# Altium schematic sheet Sheet11.SchDoc
size A4
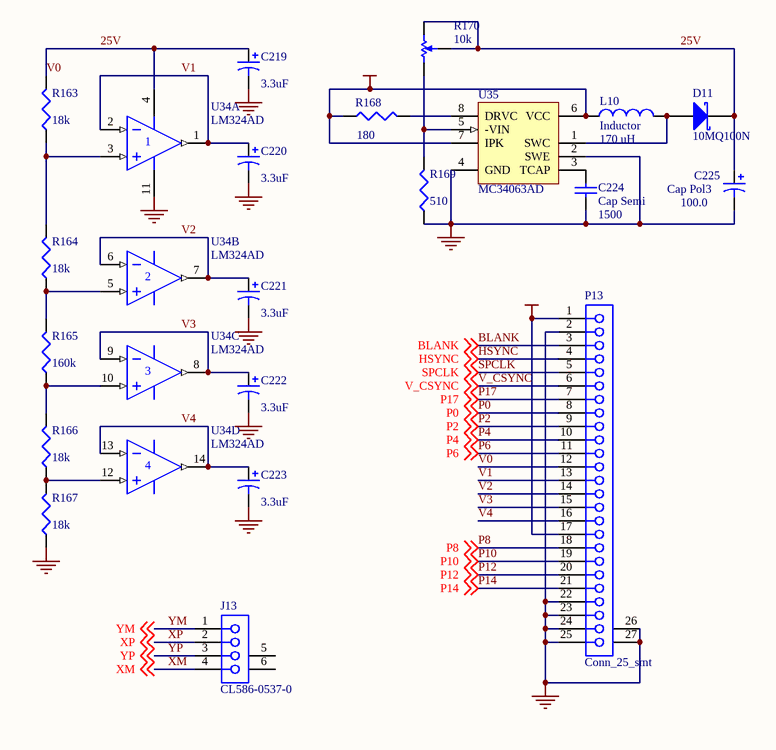
[diagram p0: Sheet11.SchDoc]

## Parts
C219  value 3.3uF  [CC2012-0805]  (hidden comment: Cap Pol3)
C220  value 3.3uF  [CC2012-0805]  (hidden comment: Cap Pol3)
C221  value 3.3uF  [CC2012-0805]  (hidden comment: Cap Pol3)
C222  value 3.3uF  [CC2012-0805]  (hidden comment: Cap Pol3)
C223  value 3.3uF  [CC2012-0805]  (hidden comment: Cap Pol3)
C224  Cap Semi  value 1500  [CC1608-0603]
C225  Cap Pol3  value 100.0  [CC5664-2225]
D11  10MQ100N  [CD4532-1812]
J13  CL586-0537-0  [FH12-10(4)SA-1SH]
L10  Inductor  value 170 uH  [INDC4532-1812]
P13  Conn_25_smt  [Conn_25_smt]
R163  value 18k  [CR1608-0603]  (hidden comment: Res3)
R164  value 18k  [CR1608-0603]  (hidden comment: Res3)
R165  value 160k  [CR1608-0603]  (hidden comment: Res3)
R166  value 18k  [CR1608-0603]  (hidden comment: Res3)
R167  value 18k  [CR1608-0603]  (hidden comment: Res3)
R168  value 180  [CR1608-0603]  (hidden comment: Res3)
R169  value 510  [CR1608-0603]  (hidden comment: Res3)
R170  10k  [POT4MM-2]
U34  LM324AD  [751A-02]  (parts A,B,C,D of 4)
U35  MC34063AD  [751-02]

## Nets
GND: C219.2 C220.2 C221.2 C222.2 C223.2 C224.1 C225.2 P13.2 P13.22 P13.23 P13.24 P13.25 P13.26(MH1) P13.27(MH2) R167.1 R169.1 U34.11(V-) U35.2(SWE) U35.4(GND)
VCC12: L10.1 R168.1 U35.6(VCC) U35.7(IPK)
VCCIO: P13.1 P13.17
25V: C219.1 C225.1 D11.2(K) P13.12 R163.2 R170.CW(+) R170.W U34.4(V+)  [also labelled V0]
BLANK: P13.3 ; off-sheet BLANK
HSYNC: P13.4 ; off-sheet HSYNC
P0: P13.8 ; off-sheet P0
P2: P13.9 ; off-sheet P2
P4: P13.10 ; off-sheet P4
P6: P13.11 ; off-sheet P6
P8: P13.18 ; off-sheet P8
P10: P13.19 ; off-sheet P10
P12: P13.20 ; off-sheet P12
P14: P13.21 ; off-sheet P14
P17: P13.7 ; off-sheet P17
SPCLK: P13.5 ; off-sheet SPCLK
V1: C220.1 P13.13 U34.1(OUT) U34.2(IN-)
V2: C221.1 P13.14 U34.6(IN-) U34.7(OUT)
V3: C222.1 P13.15 U34.8(OUT) U34.9(IN-)
V4: C223.1 P13.16 U34.13(IN-) U34.14(OUT)
V_CSYNC: P13.6 ; off-sheet V_CSYNC
XM: J13.4 ; off-sheet XM
XP: J13.2 ; off-sheet XP
YM: J13.1 ; off-sheet YM
YP: J13.3 ; off-sheet YP
NetC224_2: C224.2 U35.3(TCAP)
NetD11_1: D11.1(A) L10.2 U35.1(SWC)
NetR163_1: R163.1 R164.2 U34.3(IN+)
NetR164_1: R164.1 R165.2 U34.5(IN+)
NetR165_1: R165.1 R166.2 U34.10(IN+)
NetR166_1: R166.1 R167.2 U34.12(IN+)
NetR168_2: R168.2 U35.8(DRVC)
NetR169_2: R169.2 R170.CCW(-) U35.5(-VIN)

Not connected (* = marked no-connect by the designer): J13 5(MH1) 6(MH2)

## Library data of the parts
C219-C223 C225 = Cap Pol3: Polarized Capacitor (Surface Mount); Published: 8-Jun-2000; LatestRevisionDate: 17-Jul-2002; LatestRevisionNote: Re-released for DXP Platform.; PackageReference: C0805; Publisher: Altium Limited
C224 = Cap Semi: Capacitor (Semiconductor SIM Model); Published: 8-Jun-2000; LatestRevisionDate: 17-Jul-2002; LatestRevisionNote: Re-released for DXP Platform.; PackageReference: C1206; Publisher: Altium Limited
D11 = D Schottky: Schottky Diode; Published: 8-Jun-2000; LatestRevisionDate: 17-Jul-2002; LatestRevisionNote: Re-released for DXP Platform.; Publisher: Altium Limited; Code_JEDEC: DO-214-AA
J13 = CL586-0537-0: FH12 Series, "Flip-Lock" SMT/ZIF Connector - 1.0mm Spaced Bottom Eccentric Contact; Positions: 4; ContactMaterial: Phosphor Bronze; Current: 0.5A; PCB_Layout: Complies with manufacturer's recommendation.; Note: Pad dimensions follow nominal values, Suitable for Wave Soldering, Adjust for Re-flow.; Published: 17-Jul-2002; DatasheetDocument: 13-Nov-2000; PackageDocument: 13-Nov-2000; PackageReference: FH12-10(4)SA-1SH; Publisher: Altium Limited; ComponentLink1Description: Manufacturer Link; ComponentLink1URL: http://www.hiroseusa.com/; ComponentLink2Description: Datasheet; ComponentLink2URL: http://www.hirose.co.jp/cataloge_hp/e58605370.pdf
L10 = Inductor: Code_IEC: 1005; Published: 8-Jun-2000; LatestRevisionDate: 17-Jul-2002; LatestRevisionNote: Re-released for DXP Platform.; PackageReference: 0402-A; Publisher: Altium Limited; Code_JEITA: 0402
R163-R169 = Res3: Resistor; Published: 8-Jun-2000; LatestRevisionDate: 17-Jul-2002; LatestRevisionNote: Re-released for DXP Platform.; Publisher: Altium Limited
R170 = RPot SM: Square Trimming Potentiometer; Published: 17-Dec-2003; DatasheetDocument: Oct-2003; Publisher: Altium Limited
U34 = LM324AD: Quad Low-Power Operational Amplifier; PackageDocument: 1991; Published: 17-Jul-2002; LatestRevisionDate: 6-Jun-2005; LatestRevisionNote: Stylized 3D Model Added.; DatasheetDocument: 1988; PackageReference: 751A-02; Publisher: Altium Limited; ComponentLink1Description: Manufacturer Link; ComponentLink1URL: http://www.motorola.com/
U35 = MC34063AD: DC-to-DC Converter Control Circuit; Published: 17-Jul-2002; LatestRevisionDate: 6-Jun-2005; LatestRevisionNote: Stylized 3D Model Added.; DatasheetDocument: 1988; PackageReference: 751-02; Publisher: Altium Limited; Code_JEDEC: MS-012-AA; Code_IPC: SO8; ComponentLink1Description: Manufacturer Link; ComponentLink1URL: http://www.motorola.com/